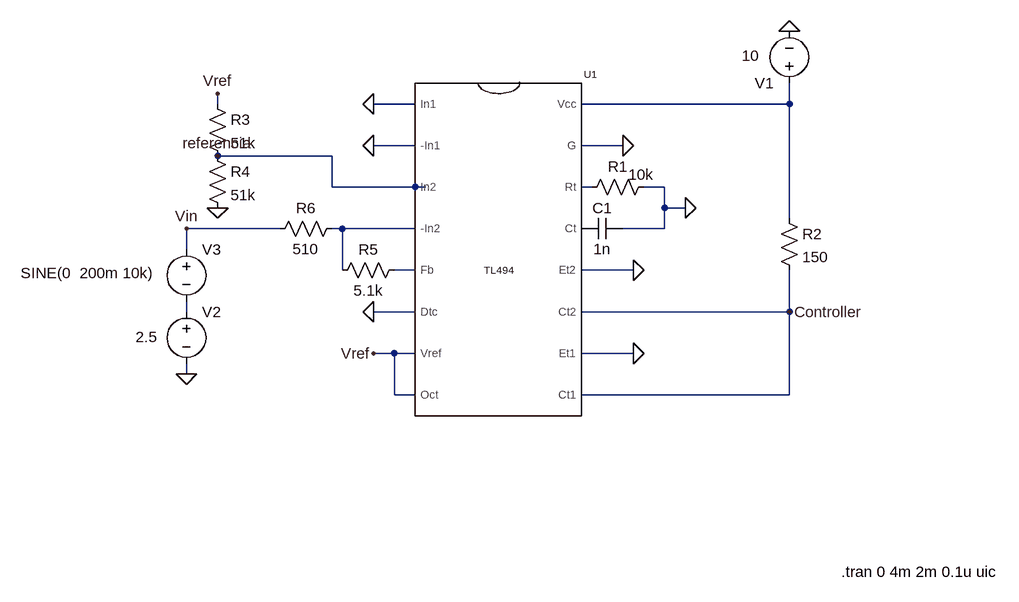
[diagram p0: schematic Banco de prueba controlador.asc]
Banco de prueba controlador.asc, the LTspice schematic file:
Version 4
SHEET 1 1064 768
WIRE -160 32 -160 16
WIRE 144 32 80 32
WIRE 720 32 720 0
WIRE 720 32 400 32
WIRE 144 96 80 96
WIRE 464 96 400 96
WIRE 16 112 -160 112
WIRE 16 160 16 112
WIRE 144 160 16 160
WIRE 160 160 144 160
WIRE 416 160 400 160
WIRE 528 160 496 160
WIRE 528 192 528 160
WIRE 560 192 528 192
WIRE 720 208 720 32
WIRE -64 224 -208 224
WIRE 32 224 16 224
WIRE 144 224 32 224
WIRE 528 224 528 192
WIRE 528 224 464 224
WIRE -208 256 -208 224
WIRE 32 288 32 224
WIRE 144 288 112 288
WIRE 480 288 400 288
WIRE -208 352 -208 336
WIRE 144 352 80 352
WIRE 720 352 720 288
WIRE 720 352 400 352
WIRE 112 416 80 416
WIRE 144 416 112 416
WIRE 480 416 400 416
WIRE -208 448 -208 432
WIRE 112 480 112 416
WIRE 144 480 112 480
WIRE 720 480 720 352
WIRE 720 480 400 480
FLAG 464 96 0
FLAG 80 32 0
FLAG 80 96 0
FLAG 80 352 0
FLAG 480 288 0
FLAG 480 416 0
FLAG 80 416 Vref
FLAG 720 352 Controller
FLAG -160 16 Vref
FLAG -160 192 0
FLAG -208 448 0
FLAG 720 -80 0
FLAG 560 192 0
FLAG -160 112 referencia
FLAG -208 224 Vin
SYMBOL tl494 272 288 R0
WINDOW 3 1 0 Center 1
SYMATTR InstName U1
SYMBOL cap 400 240 R270
WINDOW 0 32 32 VTop 2
WINDOW 3 0 32 VBottom 2
SYMATTR InstName C1
SYMATTR Value 1n
SYMBOL res 400 176 R270
WINDOW 0 32 56 VTop 2
WINDOW 3 51 92 VBottom 2
SYMATTR InstName R1
SYMATTR Value 10k
SYMBOL res 704 192 R0
SYMATTR InstName R2
SYMATTR Value 150
SYMBOL res -176 16 R0
SYMATTR InstName R3
SYMATTR Value 51k
SYMBOL res -176 96 R0
SYMATTR InstName R4
SYMATTR Value 51k
SYMBOL res 128 272 R90
WINDOW 0 0 56 VBottom 2
WINDOW 3 32 56 VTop 2
SYMATTR InstName R5
SYMATTR Value 5.1k
SYMBOL res 32 208 R90
WINDOW 0 0 56 VBottom 2
WINDOW 3 32 56 VTop 2
SYMATTR InstName R6
SYMATTR Value 510
SYMBOL voltage 720 16 R180
WINDOW 3 46 58 Left 2
WINDOW 123 0 0 Left 0
WINDOW 39 0 0 Left 0
SYMATTR Value 10
SYMATTR InstName V1
SYMBOL voltage -208 336 R0
WINDOW 123 0 0 Left 0
WINDOW 39 0 0 Left 0
WINDOW 3 -78 55 Left 2
SYMATTR InstName V2
SYMATTR Value 2.5
SYMBOL voltage -208 240 R0
WINDOW 123 0 0 Left 0
WINDOW 39 0 0 Left 0
WINDOW 3 -255 52 Left 2
SYMATTR InstName V3
SYMATTR Value SINE(0  200m 10k)
TEXT 800 752 Left 2 !.tran 0 4m 2m 0.1u uic

The netlist it stands for:
* Banco de prueba controlador.asc
XU1 0 0 referencia N003 N004 0 Vref Vref Controller 0 Controller 0 P001 N002 0 N001 TL494 TL494  ; pins In1 -In1 In2 -In2 Fb Dtc Vref Oct Ct1 Et1 Ct2 Et2 Ct Rt G Vcc
C1 P001 0 1n
R1 N002 0 10k
R2 N001 Controller 150
R3 Vref referencia 51k
R4 referencia 0 51k
R5 N004 N003 5.1k
R6 N003 Vin 510
V1 N001 0 10
V2 N005 0 2.5
V3 Vin N005 SINE(0  200m 10k)
.tran 0 4m 2m 0.1u uic
.lib tl494.sub
.backanno
.end